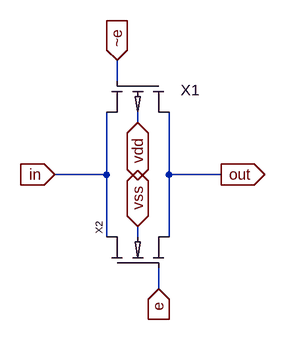
[diagram p0: schematic transmission_gate.asc]
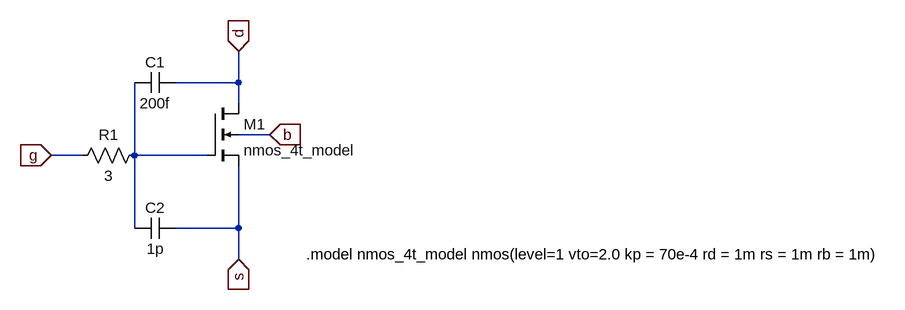
[diagram p1: sub-circuit nmos_4t.asc]
transmission_gate.asc, the LTspice schematic file:
Version 4
SHEET 1 880 680
WIRE 208 16 208 -16
WIRE 240 80 240 64
WIRE 192 160 192 64
WIRE 192 160 112 160
WIRE 288 160 288 64
WIRE 368 160 288 160
WIRE 192 256 192 160
WIRE 240 256 240 240
WIRE 288 256 288 160
WIRE 272 336 272 304
FLAG 112 160 in
IOPIN 112 160 In
FLAG 272 336 e
IOPIN 272 336 In
FLAG 368 160 out
IOPIN 368 160 Out
FLAG 208 -16 ~e
IOPIN 208 -16 In
FLAG 240 80 vdd
IOPIN 240 80 BiDir
FLAG 240 240 vss
IOPIN 240 240 BiDir
SYMBOL pmos_4t 288 16 R90
WINDOW 0 14 -47 VRight 2
SYMATTR InstName X1
SYMBOL nmos_4t 192 304 R270
SYMATTR InstName X2

nmos_4t.asc, the sub-circuit schematic file:
Version 4
SHEET 1 880 680
WIRE -288 -224 -288 -272
WIRE -288 -224 -384 -224
WIRE -288 -192 -288 -224
WIRE -240 -144 -288 -144
WIRE -528 -112 -576 -112
WIRE -448 -112 -448 -224
WIRE -336 -112 -448 -112
WIRE -448 0 -448 -112
WIRE -288 0 -288 -96
WIRE -288 0 -384 0
WIRE -288 48 -288 0
FLAG -576 -112 g
IOPIN -576 -112 In
FLAG -288 -272 d
IOPIN -288 -272 In
FLAG -288 48 s
IOPIN -288 48 In
FLAG -240 -144 b
IOPIN -240 -144 In
SYMBOL nmos4 -336 -192 R0
SYMATTR InstName M1
SYMATTR Value nmos_4t_model
SYMBOL cap -384 -240 R90
WINDOW 0 0 32 VBottom 2
WINDOW 3 32 32 VTop 2
SYMATTR InstName C1
SYMATTR Value 200f
SYMBOL cap -384 -16 R90
WINDOW 0 0 32 VBottom 2
WINDOW 3 32 32 VTop 2
SYMATTR InstName C2
SYMATTR Value 1p
SYMBOL res -432 -128 R90
WINDOW 0 0 56 VBottom 2
WINDOW 3 32 56 VTop 2
SYMATTR InstName R1
SYMATTR Value 3
TEXT -184 40 Left 2 !.model nmos_4t_model nmos(level=1 vto=2.0 kp = 70e-4 rd = 1m rs = 1m rb = 1m)

The netlist it stands for:
* transmission_gate.asc
XX1 out ~e in vdd pmos_4t  ; pins D G S B
XX2 in e out vss nmos_4t

* block symbol definitions
.subckt nmos_4t D G S B
M1 d N001 s b nmos_4t_model
C1 d N001 200f
C2 s N001 1p
R1 N001 g 3
.model nmos_4t_model nmos(level=1 vto=2.0 kp = 70e-4 rd = 1m rs = 1m rb = 1m)
.ends nmos_4t

.model NMOS NMOS
.model PMOS PMOS
.lib standard.mos
.backanno
.end